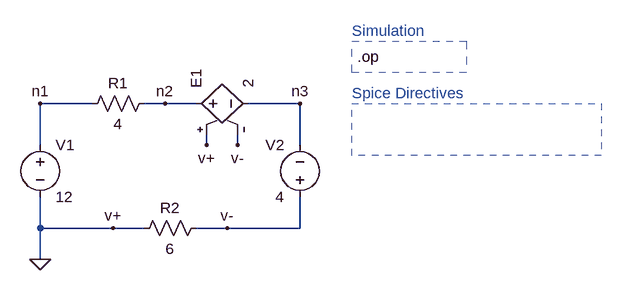
[diagram p0: schematic VCVS_e.asc]
VCVS_e.asc, the LTspice schematic file:
Version 4
SHEET 1 1432 696
WIRE 240 160 160 160
WIRE 352 160 320 160
WIRE 400 160 352 160
WIRE 560 160 480 160
WIRE 160 224 160 160
WIRE 416 224 416 208
WIRE 464 224 464 208
WIRE 560 224 560 160
WIRE 160 352 160 304
WIRE 272 352 160 352
WIRE 320 352 272 352
WIRE 448 352 400 352
WIRE 560 352 560 304
WIRE 560 352 448 352
WIRE 160 400 160 352
FLAG 272 352 v+
FLAG 448 352 v-
FLAG 416 224 v+
FLAG 464 224 v-
FLAG 160 160 n1
FLAG 352 160 n2
FLAG 560 160 n3
FLAG 160 400 0
SYMBOL e 384 160 R270
SYMATTR InstName E1
SYMATTR Value 2
SYMBOL res 336 144 R90
WINDOW 0 0 56 VBottom 2
WINDOW 3 32 56 VTop 2
SYMATTR InstName R1
SYMATTR Value 4
SYMBOL voltage 160 208 R0
SYMATTR InstName V1
SYMATTR Value 12
SYMBOL voltage 560 320 R180
WINDOW 0 24 96 Left 2
WINDOW 3 24 16 Left 2
SYMATTR InstName V2
SYMATTR Value 4
SYMBOL res 416 336 R90
WINDOW 0 0 56 VBottom 2
WINDOW 3 32 56 VTop 2
SYMATTR InstName R2
SYMATTR Value 6
TEXT 640 48 Left 2 ;Simulation
TEXT 648 88 Left 2 !.op
TEXT 640 144 Left 2 ;Spice Directives
RECTANGLE Normal 816 112 640 64 2
RECTANGLE Normal 1024 240 640 160 2

The netlist it stands for:
* VCVS_e.asc
E1 n2 n3 0 v- 2
R1 n2 n1 4
V1 n1 0 12
V2 v- n3 4
R2 v- 0 6
* Simulation
.op
* Spice Directives
.backanno
.end